# EAGLE design dwm1000 (EAGLE 7.5.0)
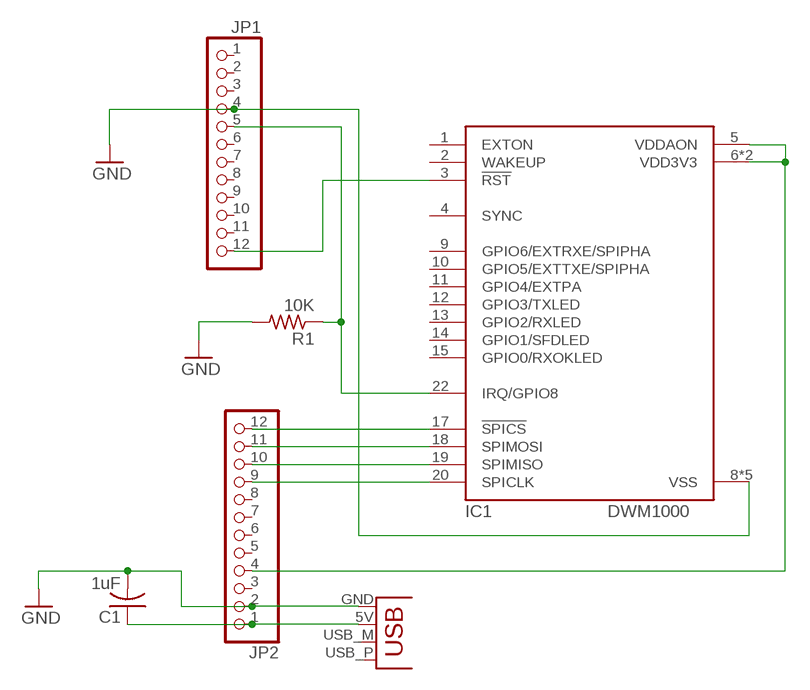
[diagram p0: schematic, sheet 1]

## Parts
C1  1uF  C-US025-024X044  [C025-024X044]
IC1  DWM1000  [DWM1000]
JP1  PINHD-1X12  [1X12]
JP2  PINHD-1X12  [1X12]
JP3  USBPCB  [USB-A-PCB]
R1  10K  R-US_0207/7  [0207/7]

## Nets
GND: C1.2 IC1.8(VSS) IC1.16(VSS) IC1.21(VSS) IC1.23(VSS) IC1.24(VSS) JP1.4 JP2.2 JP3.GND R1.2
N$1: IC1.3(!RST) JP1.12
N$2: IC1.17(!SPICS) JP2.12
N$3: IC1.18(SPIMOSI) JP2.11
N$4: IC1.20(SPICLK) JP2.9
N$5: IC1.19(SPIMISO) JP2.10
N$6: IC1.22(IRQ/GPIO8) JP1.5 R1.1
N$8: C1.1 JP2.1 JP3.5V(VBUS)
N$10: IC1.5(VDDAON) IC1.6(VDD3V3) IC1.7(VDD3V3) JP2.4
Unconnected: IC1.1(EXTON) IC1.2(WAKEUP) IC1.4(SYNC) IC1.9(GPIO6/EXTRXE/SPIPHA) IC1.10(GPIO5/EXTTXE/SPIPHA) IC1.11(GPIO4/EXTPA) IC1.12(GPIO3/TXLED) IC1.13(GPIO2/RXLED) IC1.14(GPIO1/SFDLED) IC1.15(GPIO0/RXOKLED) JP1.1 JP1.2 JP1.3 JP1.6 JP1.7 JP1.8 JP1.9 JP1.10 JP1.11 JP2.3 JP2.5 JP2.6 JP2.7 JP2.8 JP3.USB_M(D-) JP3.USB_P(D+)

## Library data of the parts
C1 = adafruit:C-US: CAPACITOR, American symbol
IC1 = decawave:DWM1000
JP1 JP2 = pinhead:PINHD-1X12: PIN HEADER
JP3 = SparkFun-Connectors:USB: USB Connectors USB-B-PTH is fully proven SKU : PRT-00139/CONN-08278 USB-miniB is fully proven SKU : PRT-00587 USB-A-PCB is untested. USB-A-H is throughly reviewed, but untested. Spark Fun Electronics SKU : PRT-00437 USB-B-SMT is throughly reviewed, but untested. Needs silkscreen touching up. USB-A-S has not been used/tested USB-MB-H has not been used/tested USB-MICROB has been used. CONN-09505
R1 = adafruit:R-US_: RESISTOR, American symbol

## Net classes
0 default: width 0.254 mm, clearance 0.254 mm

## Board
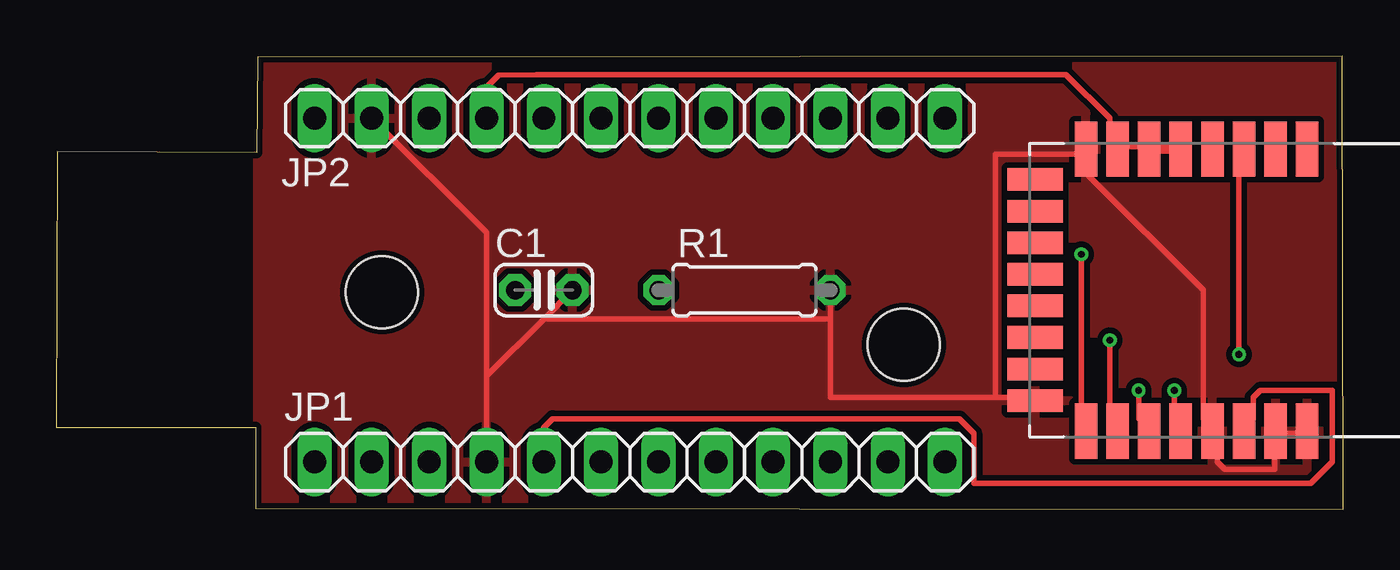
[diagram p1: board, top side]
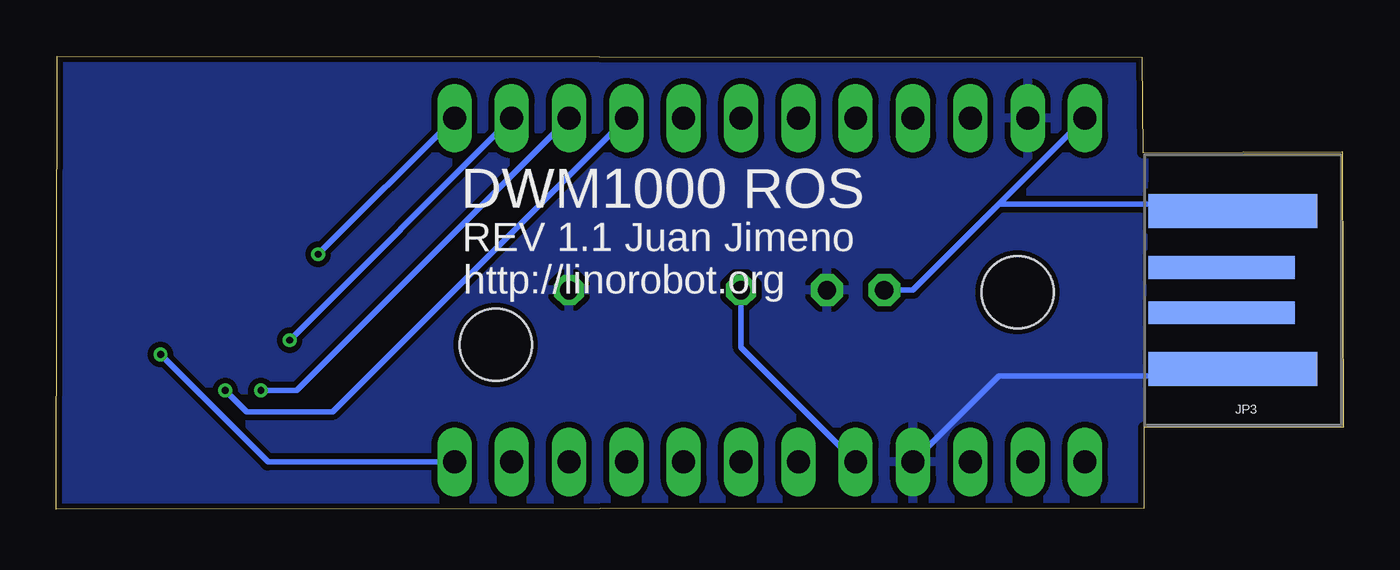
[diagram p2: board, bottom side, seen from below]

Size 57 x 20.08 mm. Coordinates in mm from the lower left corner, seen from the top.
Outline: 0,3.62 8.83,3.62 8.82,0.04 57,0 56.96,20.08 8.92,20.04 8.87,15.81 0.04,15.86 0,3.62
Copper layers (1*16): Top 0.035mm / dielectric 1.5mm / Bottom 0.035mm
Design rules "SeeedStudio_2layer_DRU_no_angle_20140221": minimum track width 6mil, minimum drill 12mil, track to track 6mil, track to pad 6mil, pad to pad 6mil, via to via 6mil, smd to smd 0mil, copper to edge 10mil, drill to drill 10mil, minimum pad ring 10mil, minimum via ring 6mil, stop-mask expansion 2mil, vias tented up to drill 100mil, thermal gap 10mil
Holes 3.2 mm at 14.43,9.63 37.54,7.29

### Footprints (pad centres in the part's own frame; a part is rotated, then mirrored left to right if it is on the bottom)
C025-024X044 = drill 0.813 pad 1.422 octagon: 1 -1.27,0; 2 1.27,0
DWM1000 = smd 2.45 x 1: 1 -6.25,0.8; 2 -6.25,-0.6; 3 -6.25,-2; 4 -6.25,-3.4; 5 -6.25,-4.8; 6 -6.25,-6.2; 7 -6.25,-7.6; 8 -6.25,-9; 17 6.25,-9; 18 6.25,-7.6; 19 6.25,-6.2; 20 6.25,-4.8; 21 6.25,-3.4; 22 6.25,-2; 23 6.25,-0.6; 24 6.25,0.8 | smd 1 x 2.45: 9 -4.9,-11.25; 10 -3.5,-11.25; 11 -2.1,-11.25; 12 -0.7,-11.25; 13 0.7,-11.25; 14 2.1,-11.25; 15 3.5,-11.25; 16 4.9,-11.25
1X12 = drill 1.016 long: 1 -13.97,0; 2 -11.43,0; 3 -8.89,0; 4 -6.35,0; 5 -3.81,0; 6 -1.27,0; 7 1.27,0; 8 3.81,0; 9 6.35,0; 10 8.89,0; 11 11.43,0; 12 13.97,0
USB-A-PCB = smd 7.5 x 1.5: 5V -0.2,-3.5; GND -0.2,3.5 | smd 6.5 x 1: USB_M 0.3,-1; USB_P 0.3,1
0207/7 = drill 0.813 octagon: 1 -3.81,0; 2 3.81,0

### Placement (x,y rotation side)
C1  21.59,9.72 0 top
IC1  54.61,9.72 270 top
JP1  25.4,2.1 0 top
JP2  25.4,17.34 0 top
JP3  5.08,9.72 180 bottom
R1  30.48,9.72 0 top

### Tracks (layer width: path | path; a pad name or v marks a point on that pad's centre or on a via)
GND
  Top 0.254: IC1.24 55.25,3.37 54.29,3.37 IC1.23 53.98,3.37 53.98,1.78 51.76,1.78 51.44,2.1 51.44,3.37 IC1.21 51.12,3.68 50.8,4 50.8,9.72 45.72,14.8 45.72,15.75 IC1.8 45.4,15.75 41.59,15.75 41.59,4.96 | 41.59,4.96 34.29,4.96 34.29,8.45 | 41.59,4.96 43.18,4.96 IC1.16 | R1.2 34.29,8.45 | 19.05,5.91 21.59,8.45 | 21.59,8.45 C1.2 | JP1.4 19.05,5.91 | JP2.2 19.05,12.26 19.05,5.91 | 21.59,8.45 34.29,8.45
  Bottom 0.254: JP1.4 15.24,5.91 5.08,5.91 JP3.GND
  pour Top: 8.91,19.97 57.02,19.97 57.02,-0.03 8.91,-0.03
  pour Bottom: 8.73,19.85 57.65,20.25 57.42,-0.66 9.03,0.02
N$1  (via drill 0.3)
  Top 0.254: v52.39,6.86 52.39,15.75 IC1.3
  Bottom 0.254: v52.39,6.86 47.63,2.1 JP1.12
N$2  (via drill 0.3)
  Top 0.254: v45.4,11.31 45.4,3.68 IC1.17
  Bottom 0.254: JP2.12 v45.4,11.31
N$3  (via drill 0.3)
  Top 0.254: v46.68,7.49 46.68,4 46.99,3.68 IC1.18
  Bottom 0.254: JP2.11 v46.68,7.49
N$4  (via drill 0.3)
  Top 0.254: v49.53,5.27 49.53,3.68 IC1.20
  Bottom 0.254: v49.53,5.27 48.58,4.32 44.77,4.32 JP2.9
N$5  (via drill 0.3)
  Top 0.254: v47.94,5.27 47.94,4 48.26,3.68 IC1.19
  Bottom 0.254: v47.94,5.27 46.36,5.27 JP2.10
N$6
  Top 0.254: JP1.5 21.59,3.61 21.98,4 21.98,4.01 40.01,4 40.64,3.37 40.64,1.14 55.57,1.14 56.52,2.1 56.52,5.27 53.34,5.27 53.02,4.96 53.02,4 52.71,3.68 IC1.22
  Bottom 0.254: R1.1 26.67,7.18 JP1.5
N$8
  Bottom 0.254: C1.1 19.05,9.72 15.24,13.53 | JP2.1 15.24,13.53 | 15.24,13.53 5.08,13.53 JP3.5V
N$10
  Top 0.254: IC1.6 48.26,16.07 47.31,16.07 IC1.7 46.99,16.07 46.68,16.39 46.68,17.34 44.72,19.27 21.26,19.26 19.59,19.25 19.05,18.72 JP2.4
  Top 0.406: IC1.6 IC1.5

### Text on the board
bNames: DWM1000 ROS | REV 1.1 Juan Jimeno | http://linorobot.org